# Altium project BUCKCONVERTER.PrjPcb (part 1 of 2)
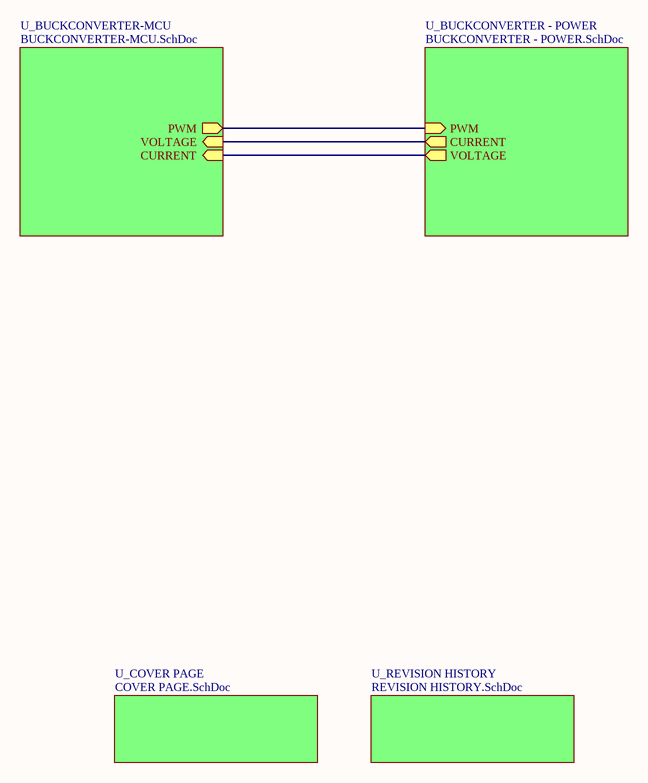
[diagram p0: OVERVIEW.SchDoc]
5 sheets, 113 parts. Net scope: hierarchical (ports join the sheet entries above them; power ports are global).
Board file: BUCKCONVERTER-V1L1.PcbDoc
Sheets:
  OVERVIEW.SchDoc
    U_BUCKCONVERTER-MCU = BUCKCONVERTER-MCU.SchDoc
    U_BUCKCONVERTER - POWER = BUCKCONVERTER - POWER.SchDoc
    U_COVER PAGE = COVER PAGE.SchDoc
    U_REVISION HISTORY = REVISION HISTORY.SchDoc

## Sheet OVERVIEW.SchDoc
size A4; SheetNumber: 1; SheetTotal: 5

### Sub-sheets
U_BUCKCONVERTER - POWER = BUCKCONVERTER - POWER.SchDoc: PWM (in), CURRENT (out), VOLTAGE (out)
U_BUCKCONVERTER-MCU = BUCKCONVERTER-MCU.SchDoc: PWM (out), VOLTAGE (in), CURRENT (in)
U_COVER PAGE = COVER PAGE.SchDoc: no entries
U_REVISION HISTORY = REVISION HISTORY.SchDoc: no entries

### Nets
CUR: sheet U_BUCKCONVERTER-MCU/VOLTAGE, sheet U_BUCKCONVERTER - POWER/CURRENT
VOL: sheet U_BUCKCONVERTER-MCU/CURRENT, sheet U_BUCKCONVERTER - POWER/VOLTAGE
NetQ4_C: sheet U_BUCKCONVERTER-MCU/PWM, sheet U_BUCKCONVERTER - POWER/PWM

## Sheet BUCKCONVERTER-MCU.SchDoc
size A4; SheetNumber: 3; SheetTotal: 5
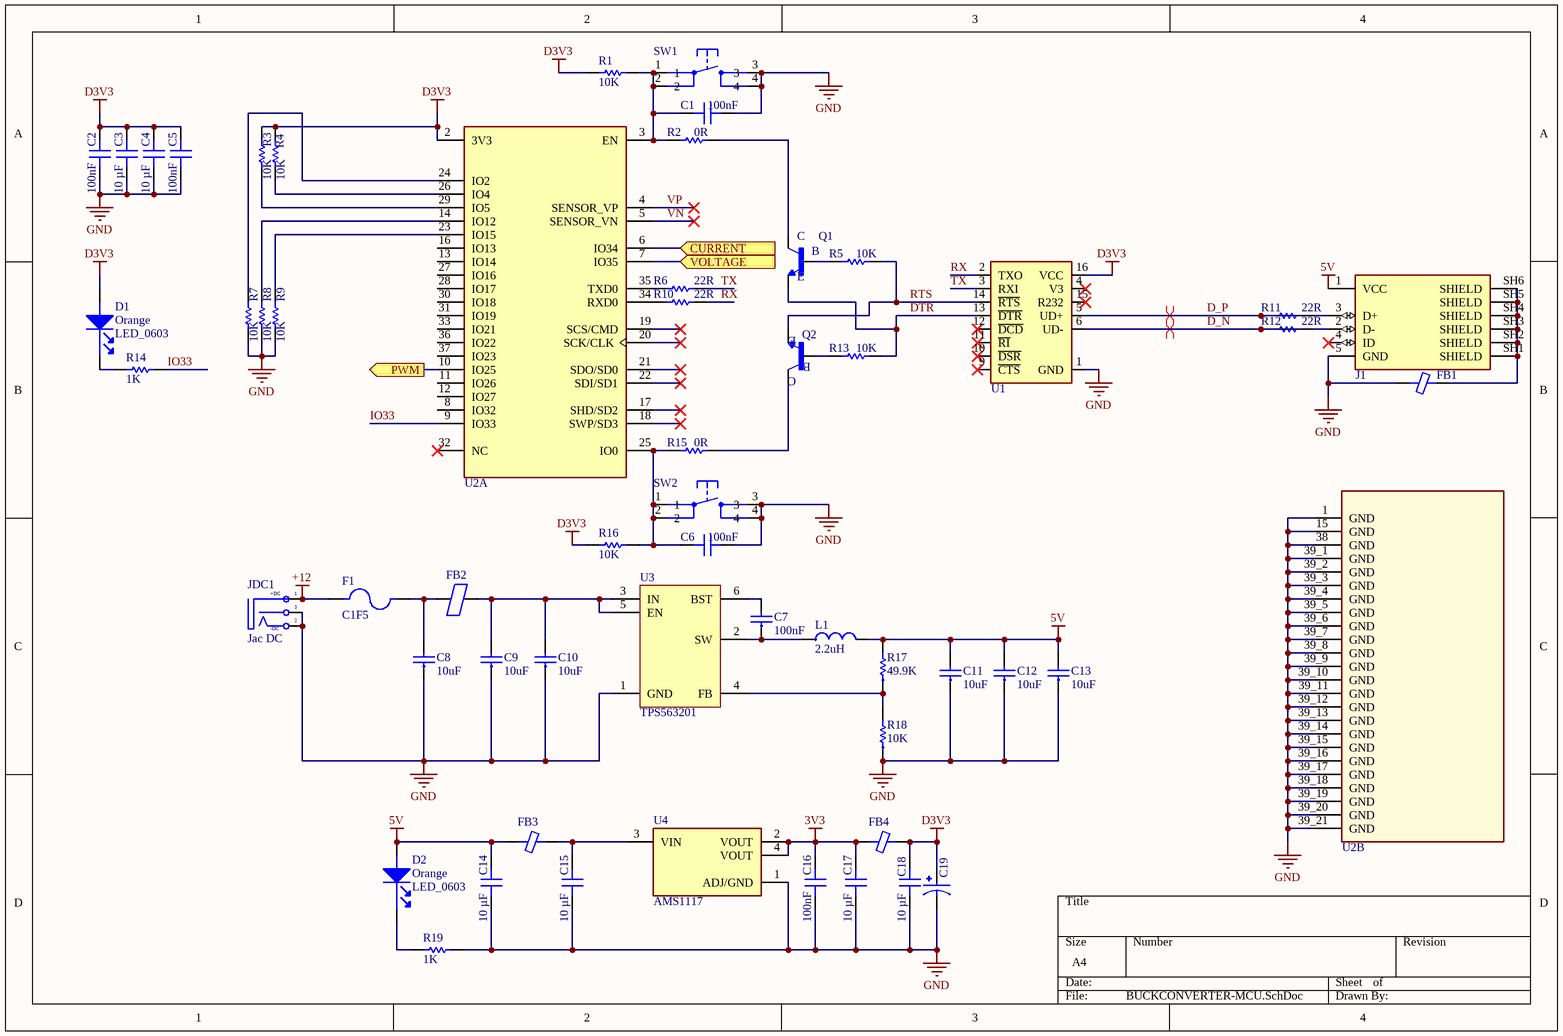
[diagram p1: BUCKCONVERTER-MCU.SchDoc]

### Parts
C1  100nF  [CAP 0603]
C2  100nF  [CAP 0603]
C3  10 µF  [CAP 0603]
C4  10 µF  [CAP 0603]
C5  100nF  [CAP 0603]
C6  100nF  [CAP 0603]
C7  100nF  [CAP-CER0603-0.8H]
C8  10uF  [CAP-CER0402-20mil]
C9  10uF  [CAP-CER0402-20mil]
C10  10uF  [CAP-CER0402-20mil]
C11  10uF  [CAP-CER0402-20mil]
C12  10uF  [CAP-CER0402-20mil]
C13  10uF  [CAP-CER0402-20mil]
C14  10 µF  [CAP 0603]
C15  10 µF  [CAP 0603]
C16  100nF  [CAP 0603]
C17  10 µF  [CAP 0603]
C18  10 µF  [CAP 0603]
C19  ECA1CHG331  [330UF-5mm]  (value not drawn)
D1  Orange  Package / Case: LED_0603  [LED]
D2  Orange  Package / Case: LED_0603  [LED]
F1  C1F5  [FUSE C1F5]
FB1  330 Ohms @ 100 MHz  [FB_0603]  (value not drawn)
FB2  100MHz 2A 50mOhm  [FB 0603]  (value not drawn)
FB3  330 Ohms @ 100 MHz  [FB_0603]  (value not drawn)
FB4  330 Ohms @ 100 MHz  [FB_0603]  (value not drawn)
J1  MICRO B  [MICRO USB B]  (value not drawn)
JDC1  Jac DC  [DC0]
L1  2.2uH  [IND-0420-2R2]
Q1  NMOS  [SOT23-3]  (value not drawn)
Q2  NMOS  [SOT23-3]  (value not drawn)
R1  10K  [Res 0603]
R2  0R  [Res 0603]
R3  10K  [Res 0603]
R4  10K  [Res 0603]
R5  10K  [Res 0603]
R6  22R  [Res 0603]
R7  10K  [Res 0603]
R8  10K  [Res 0603]
R9  10K  [Res 0603]
R10  22R  [Res 0603]
R11  22R  [Res 0603]
R12  22R  [Res 0603]
R13  10K  [Res 0603]
R14  1K  [Res 0603]
R15  0R  [Res 0603]
R16  10K  [Res 0603]
R17  49.9K  [RES-CHP0603-0.45H-272]
R18  10K  [RES-CHP0603-0.45H-272]
R19  1K  [Res 0603]
SW1  SW2  [SWITCH]  (value not drawn)
SW2  SW2  [SWITCH]  (value not drawn)
U1  CH340C  [CH340C]  (value not drawn)
U2  ESP32-WROOM-32UE-N8  [ESP32S]  (value not drawn)  (parts A,B of 2)
U3  TPS563201  [SOT23-6]
U4  AMS1117  [AMS1117]

### Ports
CURRENT (in), PWM (out), VOLTAGE (in)

### Nets
3V3: C16.2 C17.2 FB4.1 U4.2(VOUT) U4.4(VOUT)
5V: C11.2 C12.2 C13.2 C14.2 D2.1(ANODE) FB3.1 J1.1(VCC) L1.2 R17.2
+12: F1.1 JDC1.1(T)
D3V3: C2.2 C3.2 C4.2 C5.2 C18.2 C19.1 D1.1(ANODE) FB4.2 R1.1 R3.2 R4.2 R16.1 U1.16(VCC) U2.2(3V3)
GND: C1.1 C2.1 C3.1 C4.1 C5.1 C6.1 C8.1 C9.1 C10.1 C11.1 C12.1 C13.1 C14.1 C15.1 C16.1 C17.1 C18.1 C19.2 FB1.1 J1.5(GND) JDC1.2(TN) JDC1.3(S) R7.1 R8.1 R9.1 R18.1 R19.2 SW1.3 SW1.4 SW2.3 SW2.4 U1.1(GND) U2.1(GND) U2.15(GND) U2.38(GND) U2.39_1(GND) U2.39_2(GND) U2.39_3(GND) U2.39_4(GND) U2.39_5(GND) U2.39_6(GND) U2.39_7(GND) U2.39_8(GND) U2.39_9(GND) U2.39_10(GND) U2.39_11(GND) U2.39_12(GND) U2.39_13(GND) U2.39_14(GND) U2.39_15(GND) U2.39_16(GND) U2.39_17(GND) U2.39_18(GND) U2.39_19(GND) U2.39_20(GND) U2.39_21(GND) U3.1(GND) U4.1(ADJ/GND)
CUR: U2.7(IO35) ; port VOLTAGE
D_N: R12.1 U1.6(UD-)
D_P: R11.1 U1.5(UD+)
DTR: Q1.2(E) R13.2 U1.13(~{DTR})
IO33: R14.2 U2.9(IO33)
RTS: Q2.2(E) R5.2 U1.14(~{RTS})
RX: R10.2 U1.2(TXO)
TX: R6.2 U1.3(RXI)
VN: U2.5(SENSOR_VN)
VOL: U2.6(IO34) ; port CURRENT
VP: U2.4(SENSOR_VP)
NetC1_2: C1.2 R1.2 R2.1 SW1.1 SW1.2 U2.3(EN)
NetC6_2: C6.2 R15.1 R16.2 SW2.1 SW2.2 U2.25(IO0)
NetC7_1: C7.1 L1.1 U3.2(SW)
NetC7_2: C7.2 U3.6(BST)
NetC8_2: C8.2 F1.2 FB2.1
NetC9_2: C9.2 C10.2 FB2.2 U3.3(IN) U3.5(EN)
NetC15_2: C15.2 FB3.2 U4.3(VIN)
NetD1_2: D1.2(cathode) R14.1
NetD2_2: D2.2(cathode) R19.1
NetFB1_2: FB1.2 J1.SH1(SHIELD) J1.SH2(SHIELD) J1.SH3(SHIELD) J1.SH4(SHIELD) J1.SH5(SHIELD) J1.SH6(SHIELD)
NetJ1_2: J1.2(D-) R12.2
NetJ1_3: J1.3(D+) R11.2
NetQ1_1: Q1.1(B) R5.1
NetQ1_3: Q1.3(C) R2.2
NetQ2_1: Q2.1(B) R13.1
NetQ2_3: Q2.3(C) R15.2
NetQ4_C: U2.10(IO25) ; port PWM
NetR3_1: R3.1 U2.29(IO5)
NetR4_1: R4.1 U2.26(IO4)
NetR6_1: R6.1 U2.35(TXD0)
NetR7_2: R7.2 U2.24(IO2)
NetR8_2: R8.2 U2.14(IO12)
NetR9_2: R9.2 U2.23(IO15)
NetR10_1: R10.1 U2.34(RXD0)
NetR17_1: R17.1 R18.2 U3.4(FB)

Not connected (* = marked no-connect by the designer): J1 4(ID)*; U1 4(V3)* 9(~{CTS})* 10(~{DSR})* 11(~{RI})* 12(~{DCD})* 15(R232)*; U2 8(IO32) 11(IO26) 12(IO27) 13(IO14) 16(IO13) 17(SHD/SD2)* 18(SWP/SD3)* 19(SCS/CMD)* 20(SCK/CLK)* 21(SDO/SD0)* 22(SDI/SD1)* 27(IO16) 28(IO17) 30(IO18) 31(IO19) 32(NC)* 33(IO21) 36(IO22) 37(IO23)

### Layout directives
differential pair: D_N, D_P

### Notes on the sheet
- (in symbol DCIN) +DC; -DC

### Library data of the parts
C1 C2 C5 C6 C16 = GMC10X7R106K10NT: CAP0603 X7R 10UF 10% 10V; manufacturer: Cal-Chip Electronics, Inc.; Capacitance: 10 µF; Part Number: GMC10X7R106K10NT; Value: 100nF; Applications: General Purpose; componentlink1description: Datasheet; componentlink1url: https://88ce57.p3cdn1.secureserver.net/wp-content/uploads/2023/01/gmc_series-2.pdf; componentlink2description: DigiKey Link; componentlink2url: https://www.digikey.com/en/products/detail/cal-chip-electronics-inc/GMC10X7R106K10NT/18151126; Device Package: 0603 (1608 Metric); lastupdated: 2/9/2024 8:09:39 PM; Lifecycle Status: Active; Minimum Order: 1; Mounting Type: Surface Mount, MLCC; Operating Temperature: -55°C ~ 125°C; Package / Case: 0603 (1608 Metric); packaging: TapeAndReel; partid: 49835; Part Status: Active; price: 0.26; series: GMC; Size / Dimension: 0.063" L x 0.031" W (1.60mm x 0.80mm); Supplier 1: DigiKey; Supplier Part Number 1: 4713-GMC10X7R106K10NTCT-ND; Temperature Coefficient: X7R; Thickness (Max): 0.039" (1.00mm); Tolerance: ±10%; Voltage - Rated: 10V
C3 C4 C14 C15 C17 C18 = GMC10X7R106K10NT: CAP0603 X7R 10UF 10% 10V; manufacturer: Cal-Chip Electronics, Inc.; Part Number: GMC10X7R106K10NT; Value: 10 µF; Applications: General Purpose; Capacitance: 10 µF; componentlink1description: Datasheet; componentlink1url: https://88ce57.p3cdn1.secureserver.net/wp-content/uploads/2023/01/gmc_series-2.pdf; componentlink2description: DigiKey Link; componentlink2url: https://www.digikey.com/en/products/detail/cal-chip-electronics-inc/GMC10X7R106K10NT/18151126; Device Package: 0603 (1608 Metric); lastupdated: 2/9/2024 8:09:39 PM; Lifecycle Status: Active; Minimum Order: 1; Mounting Type: Surface Mount, MLCC; Operating Temperature: -55°C ~ 125°C; Package / Case: 0603 (1608 Metric); packaging: TapeAndReel; partid: 49835; Part Status: Active; price: 0.26; series: GMC; Size / Dimension: 0.063" L x 0.031" W (1.60mm x 0.80mm); Supplier 1: DigiKey; Supplier Part Number 1: 4713-GMC10X7R106K10NTCT-ND; Temperature Coefficient: X7R; Thickness (Max): 0.039" (1.00mm); Tolerance: ±10%; Voltage - Rated: 10V
C7 = CAPCER0001 100nF 10% 50V X7R 0603 SMD_1: CAP CER 100nF 10% 50V X7R 0603 SMD; LINE: SMT; TYPE: EP; UNIT: PCS; TMG CODE: None; CERTIFICATION: NA; CLASS: B; MOUNT: SMD; TMG PN: CAPCER0001; ComponentLink1Description: Datasheet; ComponentLink1URL: https://datasheet.lcsc.com/lcsc/1811021431_Samsung-Electro-Mechanics-CL10B104KB8NNNC_C1591.pdf; Footprint: 0603
C8-C13 = CAPCER0040 10uF 20% 6.3V X5R 0402 SMD: CAP CER 10uF 20% 6.3V X5R 0402 SMD; LINE: SMT; TYPE: EP; UNIT: PCS; TMG PN: CAPCER0013; TMG CODE: None; CERTIFICATION: NA; CLASS: B; MOUNT: SMD; ComponentLink1Description: Datasheet; ComponentLink1URL: https://datasheet.lcsc.com/lcsc/2304140030_YAGEO-CC0402MRX5R5BB106_C105884.pdf; Footprint: 0402
C19 = ECA1CHG331: Cap Aluminum 330uF 16V 20% (8 X 11.5mm) Radial Aluminum Cylindrical Can 3.5mm 260mA 1000 hr 105C Bulk; MP: ECA-1CHG331; MF: Panasonic; Availability: In Stock; Package: RADIAL-2 Panasonic; Check_prices: https://www.snapeda.com/parts/ECA-1CHG331/Panasonic/view-part/?ref=eda; Price: None; SnapEDA_Link: https://www.snapeda.com/parts/ECA-1CHG331/Panasonic/view-part/?ref=snap; Value: *; Purchase-URL: https://pricing.snapeda.com/search/part/ECA-1CHG331/?ref=eda
D1 D2 = LED ORANGE 606NM 0603: LED SMARTLED ORANGE 606NM 0603; Manufacturer: OSRAM Opto Semiconductors Inc; Manufacturer Part Number: LO L29K-H2K1-24-Z; Millicandela Rating: 6.3mcd; Voltage - Forward (Vf) Typ: 1.8V; Current - Test: 2mA; Wavelength - Peak: 610nm; Viewing Angle: 160°; Lens Type: Diffused; Lens Style/Size: Rectangle with Flat Top, 1.3mm x 0.8mm; Luminous Flux @ Current - Test: 25 mlm; By: Hieu.Nguyen_20191030; Supplier 1: Digi-Key; Supplier Part Number 1: 475-2740-1-ND; RoHS: RoHS Compliant; Category: Optoelectronics; Stock 1: 15900; Pricing 1: 1=0.17, 10=0.141, 100=0.1127, 250=0.0986, 500=0.09016 (USD); Color: Orange; Wavelength - Dominant: 606nm; Size / Dimension: 1.70mm L x 0.80mm W; Height: 0.65mm; Mounting Type: Surface Mount; Packaging: Cut Tape (CT); ComponentLink1URL: http://catalog.osram-os.com/catalogue/catalogue.do;jsessionid=302CF83AF637AE24E40AEB0ADA267EDD?act=downloadFile&favOid=020000010003f9de000100b6; ComponentLink1Description: http://catalog.osram-os.com/catalogue/catalogue.do;jsessionid=302CF83AF637AE24E40AEB0ADA267EDD?act=downloadFile&favOid=020000010003f9de000100b6
F1 = C1F5: Fuse Chip Fast Acting 5A 125V SMD Solder Pad 1206 3.2 X 1.58 X 0.63mm; Manufacturer: Bel TRP; Voltage Rating (DC): 63V; DC Cold Resistance: 20mR; Fuse Type: Board Mount (Cartridge Style Excluded); Supplier 1: Newark; Manufacturer Part Number: C1F5; RoHS: Yes; Category: Uncategorized; Mount: Surface Mount; Case/Package: 1206; Number of Pins: 2; Contact Plating: Tin; Case Code (Metric): 3216; Case Code (Imperial): 1206; Min Operating Temperature: -55°C; Max Operating Temperature: 125°C; Packaging: Cut Tape; Voltage Rating: 125V; Series: C1F; Voltage Rating (AC): 125V; ComponentLink1URL: http://www.mouser.com/ds/2/643/C1F-594910.pdf?src-supplier=Mouser; ComponentLink1Description: http://www.mouser.com/ds/2/643/C1F-594910.pdf?src-supplier=Mouser; ComponentLink2URL: http://belfuse.com/pdfs/C1F.pdf?src-supplier=Avnet; ComponentLink2Description: http://belfuse.com/pdfs/C1F.pdf?src-supplier=Avnet; ComponentLink3URL: https://belfuse.com/resources/datasheets/circuitprotection/ds-cp-c1f-series.pdf?src-supplier=Digikey; ComponentLink3Description: https://belfuse.com/resources/datasheets/circuitprotection/ds-cp-c1f-series.pdf?src-supplier=Digikey; Supplier Part Number 1: 48AC8480
FB1 FB3 FB4 = BLM18KG331SH1D: FERRITE BEAD 330 OHM 0603 1LN; Manufacturer: Murata Electronics; Current Rating (Max): 1.7A; DC Resistance (DCR) (Max): 80mOhm; Filter Type: Power Line; Number of Lines: 1; Part Number: BLM18KG331SH1D; ComponentLink1Description: Datasheet; ComponentLink1URL: https://www.murata.com/en-global/products/productdata/8796737273886/QNFA9101.pdf; ComponentLink2Description: DigiKey Link; ComponentLink2URL: https://www.digikey.com/en/products/detail/murata-electronics/BLM18KG331SH1D/5881246; Device Package: 0603 (1608 Metric); Height (Max): 0.037" (0.95mm); Impedance @ Frequency: 330 Ohms @ 100 MHz; LastUpdated: 3/11/2024 7:43:28 AM; Lifecycle Status: Active; Minimum Order: 1; Mounting Type: Surface Mount; Operating Temperature: -55°C ~ 125°C; Package / Case: 0603 (1608 Metric); Packaging: TapeAndReel; PartId: 932; Part Status: Active; Price: 0.02; Ratings: AEC-Q200; Series: EMIFIL®, BLM18; Size / Dimension: 0.063" L x 0.032" W (1.60mm x 0.80mm); Supplier 1: DigiKey; Supplier Part Number 1: 490-13257-1-ND; Value: 330 Ohms @ 100 MHz
FB2 = BLM18PG121SN1D: Ferrite Beads Multi-Layer 120Ohm 25% 100MHz 2A 50mOhm DCR 0603 Paper T/R; Manufacturer: Murata; Material: Steel,Ferrite; Impedance: 120R; Number of Lines: 1; DC Resistance (DCR): 50mR; Number of Circuits: 1NUMBER; Shielding: 202Shielding; Supplier 1: Mouser; Manufacturer Part Number: BLM18PG121SN1D; RoHS: Yes; Category: Ferrite Beads and Chips; Stock 1: 377848; Pricing 1: 1=0.1, 10=0.059, 50=0.047, 100=0.042, 1000=0.029, 10000=0.018 (USD); Case/Package: 0603; Number of Pins: 2; Core Material: Ferrite; Case Code (Metric): 1608; Case Code (Imperial): 0603; Min Operating Temperature: -55°C; Max Operating Temperature: 125°C; Tolerance: 25%; Package Quantity: 1; Max Current Rating: 2A; Packaging: Tape and Reel; Current Rating: 2A; Max DC Current: 2A; Termination: SMD/SMT; Test Frequency: 100MHz; DC Current: 2A; Frequency: 100MHz; Series: BLM18P; DC Resistance-Max: 50mR; RMS Current (Irms): 2A; Series Resistance: 50mR; Length: 1.6mm; Width: 0.8mm; Height: 0.8mm; Depth: 0.8mm; Radiation Hardening: No; Reach SVHC Compliant: No; Lead Free: Lead Free; RoHS Compliant: Yes; ComponentLink1URL: https://datasheet.ciiva.com/5709/1740433-5709171.pdf?src-supplier=Farnell; ComponentLink1Description: https://datasheet.ciiva.com/5709/1740433-5709171.pdf?src-supplier=Farnell; ComponentLink2URL: https://datasheet.ciiva.com/19454/1845013-19454715.pdf?src-supplier=Jameco; ComponentLink2Description: https://datasheet.ciiva.com/19454/1845013-19454715.pdf?src-supplier=Jameco; ComponentLink3URL: https://datasheet.ciiva.com/11799/0900766b81275ca5-11799546.pdf?src-supplier=Rs; ComponentLink3Description: https://datasheet.ciiva.com/11799/0900766b81275ca5-11799546.pdf?src-supplier=Rs; ComponentLink4URL: https://datasheet.ciiva.com/3854/5emiapbde-1-3854039.pdf?src-supplier=Arrow+Electronics; ComponentLink4Description: https://datasheet.ciiva.com/3854/5emiapbde-1-3854039.pdf?src-supplier=Arrow+Electronics; ComponentLink5URL: https://datasheet.ciiva.com/29347/442365-da-01-en-chip-drossel-0603-120r-2000ma-1-6x0-8mm-29347911.pdf?src-supplier=Conrad; ComponentLink5Description: https://datasheet.ciiva.com/29347/442365-da-01-en-chip-drossel-0603-120r-2000ma-1-6x0-8mm-29347911.pdf?src-supplier=Conrad; ComponentLink6URL: https://datasheet.ciiva.com/8021/1740433-8021493.pdf?src-supplier=Element14; ComponentLink6Description: https://datasheet.ciiva.com/8021/1740433-8021493.pdf?src-supplier=Element14; ComponentLink7URL: https://datasheet.ciiva.com/8021/1740433-8021494.pdf?src-supplier=Element14; ComponentLink7Description: https://datasheet.ciiva.com/8021/1740433-8021494.pdf?src-supplier=Element14; ComponentLink8URL: https://datasheet.ciiva.com/14122/blm-series-eng-tds-14122905.pdf?src-supplier=Distrelec; ComponentLink8Description: https://datasheet.ciiva.com/14122/blm-series-eng-tds-14122905.pdf?src-supplier=Distrelec; ComponentLink9URL: https://datasheet.ciiva.com/6212/l0110s0100blm18p-6212502.pdf?src-supplier=Digikey; ComponentLink9Description: https://datasheet.ciiva.com/6212/l0110s0100blm18p-6212502.pdf?src-supplier=Digikey; ComponentLink10URL: https://datasheet.ciiva.com/6212/l0110s0100blm18p-6212504.pdf?src-supplier=Digikey; ComponentLink10Description: https://datasheet.ciiva.com/6212/l0110s0100blm18p-6212504.pdf?src-supplier=Digikey; ComponentLink11URL: https://datasheet.ciiva.com/3081/l0110s0100blm18p-3081632.pdf?src-supplier=Avnet; ComponentLink11Description: https://datasheet.ciiva.com/3081/l0110s0100blm18p-3081632.pdf?src-supplier=Avnet; ComponentLink12URL: https://datasheet.ciiva.com/41449/001172297-da-01-en-drossel-0603-120r-1-6x0-8mm-4000st-41449659.pdf?src-supplier=Conrad; ComponentLink12Description: https://datasheet.ciiva.com/41449/001172297-da-01-en-drossel-0603-120r-1-6x0-8mm-4000st-41449659.pdf?src-supplier=Conrad; Supplier Part Number 1: 81-BLM18PG121SN1D
J1 = MICRO USB B
JDC1 = DCIN: Jac DC input; Value: Jac DC
L1 = INDMOI0016 1W2T 2.2uH 20% 5A 0420 SMD: IND MOI 1W2T 2.2uH 20% 5A 0420 SMD; LINE: SMT; TYPE: EP; UNIT: PCS; TMG CODE: None; CERTIFICATION: NA; CLASS: B; MOUNT: SMD; ComponentLink1Description: Datasheet; ComponentLink1URL: https://datasheet.lcsc.com/lcsc/2305161117_cjiang--Changjiang-Microelectronics-Tech-FXL0420-2R2-M_C167206.pdf
Q1 Q2 = MMBT3904: MMBT3904 Series 40 V CE Breakdown 0.2 A NPN General Purpose Amplifier - SOT-23; Manufacturer: onsemi; Collector Emitter Voltage (VCEO): 40V; hFE Min: 100; Max Power Dissipation: 350mW; Max Collector Current: 200mA; Transition Frequency: 300MHz; Collector Base Voltage (VCBO): 60V; Emitter Base Voltage (VEBO): 6V; Collector Emitter Saturation Voltage: 300mV; Supplier 1: Farnell; Manufacturer Part Number: MMBT3904; RoHS: Yes; Category: BJTs; Pricing 1: 5=0,136, 25=0,133, 100=0,0476, 250=0,0435, 500=0,043, 1000=0,022, 5000=0,02 (GBP); Mount: Surface Mount; Case/Package: SOT-23; Number of Pins: 3; Weight: 0.03g; Min Operating Temperature: -55°C; Max Operating Temperature: 150°C; Packaging: Tape and Reel; Polarity: NPN; Collector Emitter Breakdown Voltage: 40V; Voltage Rating (DC): 40V; Package Quantity: 1; Max Breakdown Voltage: 40V; Current Rating: 200mA; Series: -; Collector-emitter Voltage-Max: 300mV; Termination: SMD/SMT; Radiation Hardening: No; RoHS Compliant: Yes; Reach SVHC Compliant: No; Lead Free: Lead Free; Supplier Part Number 1: 9846727
R1-R16 R19 = Resistor 2.2K: Res Thick Film 0603 2.2K Ohm 5% 1/10W ±200ppm/°C Molded SMD SMD Paper T/R; Manufacturer: Vishay; Manufacturer Part Number: CRCW06032K20JNEA; Resistance: 2.2kR; Power Rating: 100mW; Voltage Rating: 75V; Supplier 1: Arrow Electronics; RoHS: Yes; Category: Chip SMD Resistors; Stock 1: 130000; Pricing 1: 5000=0.0053 (USD); Case/Package: 0603; Weight: 7.1E-05oz; Case Code (Metric): 1608; Case Code (Imperial): 0603; Contact Plating: Tin; Size Code: 0603; Min Operating Temperature: -55°C; Max Operating Temperature: 155°C; Package Quantity: 5000; Tolerance: 5%; Packaging: Tape and Reel; Resistor Type: Thick Film; Number of Terminations: 2; Temperature Coefficient: 200ppm/°C; Termination: SMD/SMT; Max Power Dissipation: 100mW; Features: Automotive AEC-Q200; Series: CRCW; Resistance Tolerance: 5%; Construction: Rectangular; Length: 1.55mm; Width: 0.85mm; Height: 0.45mm; Depth: 0.85mm; Ratings: AEC-Q200; Radiation Hardening: No; Military Standard: Not; RoHS Compliant: Yes; Reach SVHC Compliant: Unknown; Lead Free: 5697LeadFree; ComponentLink1URL: https://datasheet.ciiva.com/2462/dcrcwe3-2462048.pdf?src-supplier=Digikey; ComponentLink1Description: https://datasheet.ciiva.com/2462/dcrcwe3-2462048.pdf?src-supplier=Digikey; ComponentLink2URL: https://datasheet.ciiva.com/16767/70201119-16767464.pdf?src-supplier=Allied+Electronics; ComponentLink2Description: https://datasheet.ciiva.com/16767/70201119-16767464.pdf?src-supplier=Allied+Electronics; ComponentLink3URL: https://datasheet.ciiva.com/2462/dcrcwe3-2462046.pdf?src-supplier=Digikey; ComponentLink3Description: https://datasheet.ciiva.com/2462/dcrcwe3-2462046.pdf?src-supplier=Digikey; ComponentLink4URL: https://datasheet.ciiva.com/5541/dcrcwe3-109170-5541959.pdf?src-supplier=Mouser; ComponentLink4Description: https://datasheet.ciiva.com/5541/dcrcwe3-109170-5541959.pdf?src-supplier=Mouser; ComponentLink5URL: https://datasheet.ciiva.com/16286/dcrcwe3-16286997.pdf?src-supplier=Future+Electronics; ComponentLink5Description: https://datasheet.ciiva.com/16286/dcrcwe3-16286997.pdf?src-supplier=Future+Electronics; Supplier Part Number 1: CRCW06032K20JNEA
R17 R18 = RESCHP0195 2K7 1% 0603 SMD: RES CHP 2K7 1% 1/10W 0603 SMD; LINE: SMT; UNIT: PCS; TMG CODE: None; CERTIFICATION: NA; CLASS: B; MOUNT: SMD; TYPE: EP; TMG PN: RESCHP0195; ComponentLink1Description: Datasheet; ComponentLink1URL: https://datasheet.lcsc.com/lcsc/2304140030_YAGEO-RC0603FR-072K7L_C114612.pdf; Footprint: 0603
SW1 SW2 = SW2: Switch button 4 pin
U2 = ESP32-WROOM-32UE-N8: Multiprotocol Modules SMD module ESP32-WROOM-32UE, ESP32-D0WD-V3, ESP32 ECO V3,; Manufacturer: Espressif Systems; Supplier 1: Digikey; Manufacturer Part Number: ESP32-WROOM-32UE-N8; RoHS: No; Category: LDO; Stock 1: 3266; Pricing 1: 1=5,28, 10=4,566, 25=4,3196, 100=3,9802, 250=3,7768 (USD); ComponentLink1URL: https://datasheet.octopart.com/ESP32-WROOM-32UE-N8-Espressif-Systems-datasheet-188867343.pdf?src-supplier=TME; ComponentLink1Description: https://datasheet.octopart.com/ESP32-WROOM-32UE-N8-Espressif-Systems-datasheet-188867343.pdf?src-supplier=TME; Supplier Part Number 1: 1965-ESP32-WROOM-32UE-N8CT-ND
U3 = ICSOCV0021 BCK TPS563201 3A SOT23-6 SMD: ICS OCV BCK TPS563201 3A SOT23-6 SMD; LINE: SMT; UNIT: PCS; TMG CODE: None; CERTIFICATION: NA; CLASS: B; MOUNT: SMD; TYPE: EP; ComponentLink1Description: Datasheet; ComponentLink1URL: https://datasheet.lcsc.com/lcsc/2304241919_Texas-Instruments-TPS563201DDCR_C116592.pdf
U4 = AMS1117: 1A LOW DROPOUT VOLTAGE REGULATOR SOT-223; MF: Advanced Monolithic Systems; Price: None; Availability: Not in stock; Package: SOT-223 Seeed Technology; MP: AMS1117; Value: *; SnapEDA_Link: https://www.snapeda.com/parts/AMS1117/Advanced+Monolithic+Systems/view-part/?ref=snap; Check_prices: https://www.snapeda.com/parts/AMS1117/Advanced+Monolithic+Systems/view-part/?ref=eda